# Altium schematic sheet Main.SchDoc
size 83 x 31 mm
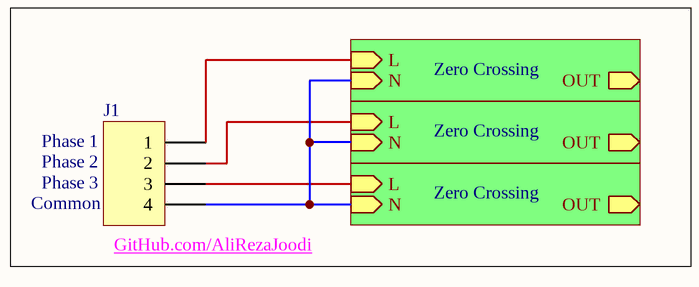
[diagram p0: Main.SchDoc]

## Parts
J1  Header 4  [Fonics_4PIN_1]  (value not drawn)

## Sub-sheets
Zero Crossing = Zero Crossing.SchDoc: L (in), N (in), OUT (out)
Zero Crossing = Zero Crossing.SchDoc: L (in), N (in), OUT (out)
Zero Crossing = Zero Crossing.SchDoc: L (in), N (in), OUT (out)

## Nets
NetJ1_1: J1.1 ; sheet Zero Crossing/L
NetJ1_2: J1.2 ; sheet Zero Crossing/L
NetJ1_3: J1.3 ; sheet Zero Crossing/L
NetJ1_4: J1.4 ; sheet Zero Crossing/N, sheet Zero Crossing/N, sheet Zero Crossing/N

## Notes on the sheet
- (near J1) Phase 1
- (near J1) Phase 2
- (near J1) Phase 3
- (near J1) Common
- (near J1) GitHub.com/AliRezaJoodi

## Library data of the parts
J1 = Header 4: Header, 4-Pin; Manufacturer: Generic Components; Class I: Connector; Revision: July-2002: Re-released for DXP Platform.; Publisher: Altium Limited